# Altium schematic sheet core_power.SchDoc
size A4
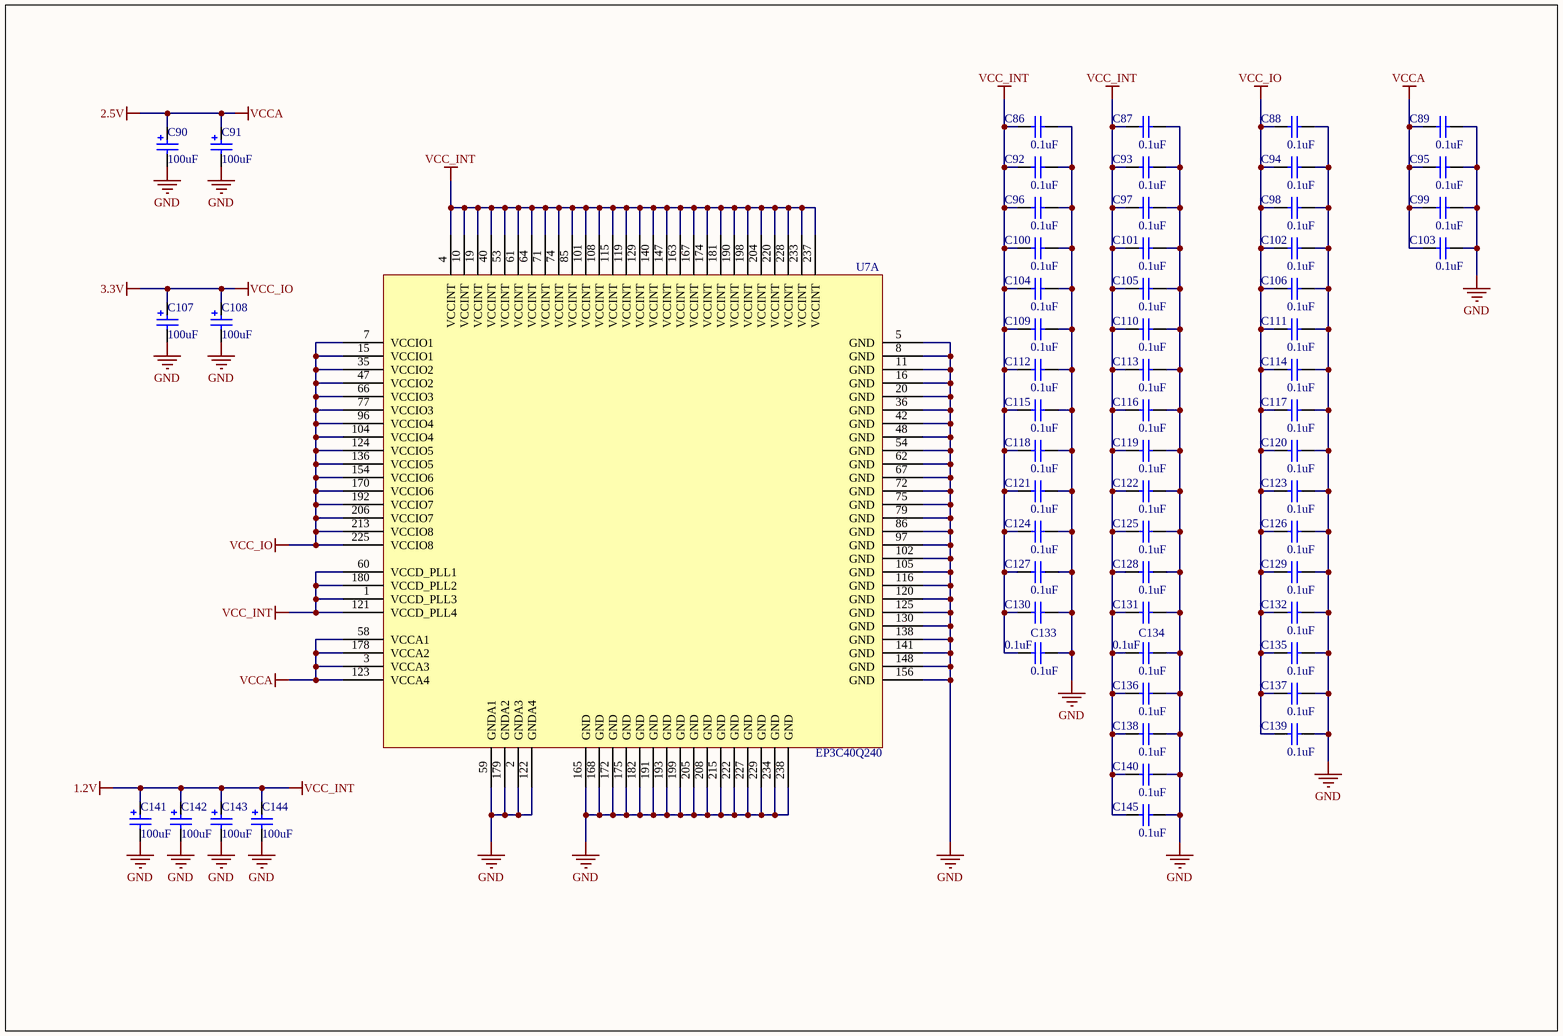
[diagram p0: core_power.SchDoc]

## Parts
C86  value 0.1uF  [0402]  (hidden comment: Cap)
C87  value 0.1uF  [0402]  (hidden comment: Cap)
C88  value 0.1uF  [0402]  (hidden comment: Cap)
C89  value 0.1uF  [0402]  (hidden comment: Cap)
C90  value 100uF  [C1206_POLARIZED]  (hidden comment: Cap)
C91  value 100uF  [C1206_POLARIZED]  (hidden comment: Cap)
C92  value 0.1uF  [0402]  (hidden comment: Cap)
C93  value 0.1uF  [0402]  (hidden comment: Cap)
C94  value 0.1uF  [0402]  (hidden comment: Cap)
C95  value 0.1uF  [0402]  (hidden comment: Cap)
C96  value 0.1uF  [0402]  (hidden comment: Cap)
C97  value 0.1uF  [0402]  (hidden comment: Cap)
C98  value 0.1uF  [0402]  (hidden comment: Cap)
C99  value 0.1uF  [0402]  (hidden comment: Cap)
C100  value 0.1uF  [0402]  (hidden comment: Cap)
C101  value 0.1uF  [0402]  (hidden comment: Cap)
C102  value 0.1uF  [0402]  (hidden comment: Cap)
C103  value 0.1uF  [0402]  (hidden comment: Cap)
C104  value 0.1uF  [0402]  (hidden comment: Cap)
C105  value 0.1uF  [0402]  (hidden comment: Cap)
C106  value 0.1uF  [0402]  (hidden comment: Cap)
C107  value 100uF  [C1206_POLARIZED]  (hidden comment: Cap)
C108  value 100uF  [C1206_POLARIZED]  (hidden comment: Cap)
C109  value 0.1uF  [0402]  (hidden comment: Cap)
C110  value 0.1uF  [0402]  (hidden comment: Cap)
C111  value 0.1uF  [0402]  (hidden comment: Cap)
C112  value 0.1uF  [0402]  (hidden comment: Cap)
C113  value 0.1uF  [0402]  (hidden comment: Cap)
C114  value 0.1uF  [0402]  (hidden comment: Cap)
C115  value 0.1uF  [0402]  (hidden comment: Cap)
C116  value 0.1uF  [0402]  (hidden comment: Cap)
C117  value 0.1uF  [0402]  (hidden comment: Cap)
C118  value 0.1uF  [0402]  (hidden comment: Cap)
C119  value 0.1uF  [0402]  (hidden comment: Cap)
C120  value 0.1uF  [0402]  (hidden comment: Cap)
C121  value 0.1uF  [0402]  (hidden comment: Cap)
C122  value 0.1uF  [0402]  (hidden comment: Cap)
C123  value 0.1uF  [0402]  (hidden comment: Cap)
C124  value 0.1uF  [0402]  (hidden comment: Cap)
C125  value 0.1uF  [0402]  (hidden comment: Cap)
C126  value 0.1uF  [0402]  (hidden comment: Cap)
C127  value 0.1uF  [0402]  (hidden comment: Cap)
C128  value 0.1uF  [0402]  (hidden comment: Cap)
C129  value 0.1uF  [0402]  (hidden comment: Cap)
C130  value 0.1uF  [0402]  (hidden comment: Cap)
C131  value 0.1uF  [0402]  (hidden comment: Cap)
C132  value 0.1uF  [0402]  (hidden comment: Cap)
C133  value 0.1uF  [0402]  (hidden comment: Cap)
C134  value 0.1uF  [0402]  (hidden comment: Cap)
C135  value 0.1uF  [0402]  (hidden comment: Cap)
C136  value 0.1uF  [0402]  (hidden comment: Cap)
C137  value 0.1uF  [0402]  (hidden comment: Cap)
C138  value 0.1uF  [0402]  (hidden comment: Cap)
C139  value 0.1uF  [0402]  (hidden comment: Cap)
C140  value 0.1uF  [0402]  (hidden comment: Cap)
C141  value 100uF  [C1206_POLARIZED]  (hidden comment: Cap Pol2)
C142  value 100uF  [C1206_POLARIZED]  (hidden comment: Cap Pol2)
C143  value 100uF  [C1206_POLARIZED]  (hidden comment: Cap)
C144  value 100uF  [C1206_POLARIZED]  (hidden comment: Cap)
C145  value 0.1uF  [0402]  (hidden comment: Cap)
U7  EP3C40Q240  [PQFP240]  (part A of 3)

## Nets
1.2V: C86.1 C87.1 C92.1 C93.1 C96.1 C97.1 C100.1 C101.1 C104.1 C105.1 C109.1 C110.1 C112.1 C113.1 C115.1 C116.1 C118.1 C119.1 C121.1 C122.1 C124.1 C125.1 C127.1 C128.1 C130.1 C131.1 C133.1 C134.1 C136.1 C138.1 C140.1 C141.1 C142.1 C143.1 C144.1 C145.1 U7.1(VCCD_PLL3) U7.4(VCCINT) U7.10(VCCINT) U7.19(VCCINT) U7.40(VCCINT) U7.53(VCCINT) U7.60(VCCD_PLL1) U7.61(VCCINT) U7.64(VCCINT) U7.71(VCCINT) U7.74(VCCINT) U7.85(VCCINT) U7.101(VCCINT) U7.108(VCCINT) U7.115(VCCINT) U7.119(VCCINT) U7.121(VCCD_PLL4) U7.129(VCCINT) U7.140(VCCINT) U7.147(VCCINT) U7.163(VCCINT) U7.167(VCCINT) U7.174(VCCINT) U7.180(VCCD_PLL2) U7.181(VCCINT) U7.190(VCCINT) U7.198(VCCINT) U7.204(VCCINT) U7.220(VCCINT) U7.228(VCCINT) U7.233(VCCINT) U7.237(VCCINT)  [also labelled VCC_INT]
2.5V: C89.1 C90.1 C91.1 C95.1 C99.1 C103.1 U7.3(VCCA3) U7.58(VCCA1) U7.123(VCCA4) U7.178(VCCA2)  [also labelled VCCA]
3.3V: C88.1 C94.1 C98.1 C102.1 C106.1 C107.1 C108.1 C111.1 C114.1 C117.1 C120.1 C123.1 C126.1 C129.1 C132.1 C135.1 C137.1 C139.1 U7.7(VCCIO1) U7.15(VCCIO1) U7.35(VCCIO2) U7.47(VCCIO2) U7.66(VCCIO3) U7.77(VCCIO3) U7.96(VCCIO4) U7.104(VCCIO4) U7.124(VCCIO5) U7.136(VCCIO5) U7.154(VCCIO6) U7.170(VCCIO6) U7.192(VCCIO7) U7.206(VCCIO7) U7.213(VCCIO8) U7.225(VCCIO8)  [also labelled VCC_IO]
GND: C86.2 C87.2 C88.2 C89.2 C90.2 C91.2 C92.2 C93.2 C94.2 C95.2 C96.2 C97.2 C98.2 C99.2 C100.2 C101.2 C102.2 C103.2 C104.2 C105.2 C106.2 C107.2 C108.2 C109.2 C110.2 C111.2 C112.2 C113.2 C114.2 C115.2 C116.2 C117.2 C118.2 C119.2 C120.2 C121.2 C122.2 C123.2 C124.2 C125.2 C126.2 C127.2 C128.2 C129.2 C130.2 C131.2 C132.2 C133.2 C134.2 C135.2 C136.2 C137.2 C138.2 C139.2 C140.2 C141.2 C142.2 C143.2 C144.2 C145.2 U7.2(GNDA3) U7.5(GND) U7.8(GND) U7.11(GND) U7.16(GND) U7.20(GND) U7.36(GND) U7.42(GND) U7.48(GND) U7.54(GND) U7.59(GNDA1) U7.62(GND) U7.67(GND) U7.72(GND) U7.75(GND) U7.79(GND) U7.86(GND) U7.97(GND) U7.102(GND) U7.105(GND) U7.116(GND) U7.120(GND) U7.122(GNDA4) U7.125(GND) U7.130(GND) U7.138(GND) U7.141(GND) U7.148(GND) U7.156(GND) U7.165(GND) U7.168(GND) U7.172(GND) U7.175(GND) U7.179(GNDA2) U7.182(GND) U7.191(GND) U7.193(GND) U7.199(GND) U7.205(GND) U7.208(GND) U7.215(GND) U7.222(GND) U7.227(GND) U7.229(GND) U7.234(GND) U7.238(GND)

## Library data of the parts
C86-C89 C92-C106 C109-C140 C145 = Cap: Capacitor; Published: 8-Jun-2000; LatestRevisionDate: 17-Jul-2002; LatestRevisionNote: Re-released for DXP Platform.; PackageReference: RAD-0.3; Publisher: Altium Limited; PackageDescription: Radial Cap, Thru-Hole; 2 Leads; 0.3 in Pin Spacing
C90 C91 C107 C108 C141-C144 = Cap Pol2: Polarized Capacitor (Axial); Published: 8-Jun-2000; LatestRevisionDate: 17-Jul-2002; LatestRevisionNote: Re-released for DXP Platform.; PackageReference: POLAR0.8; Publisher: Altium Limited; PackageDescription: Polarized Capacitor; 2 Leads